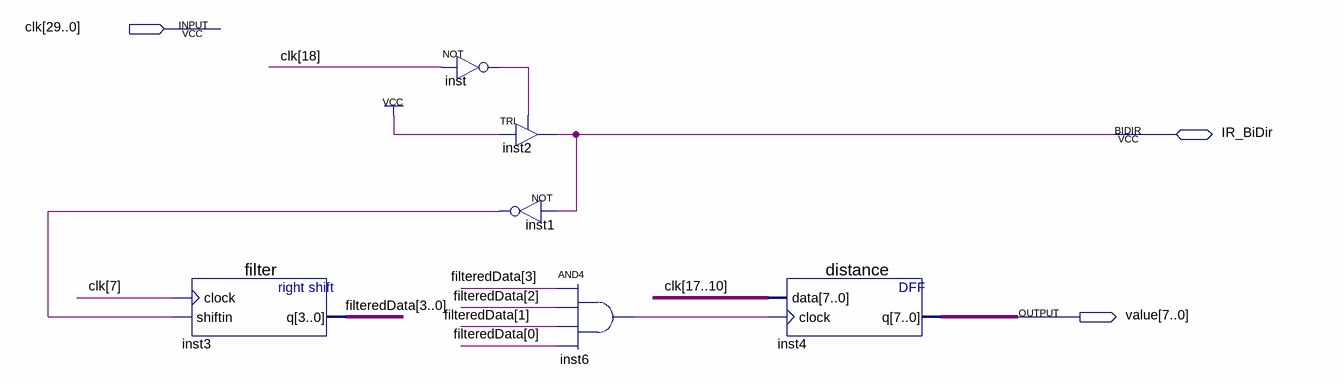
[diagram p0: schematic sheet]
// Quartus schematic IR_Sensor.bdf as structural Verilog: 6 symbols, 3 pins
module IR_Sensor (
  input  [29:0] clk,
  inout  IR_BiDir,
  output [7:0] value
);

  wire inst1_out, inst6_out, inst_out;
  wire [3:0] filteredData;

  filter inst3 (.clock(clk[7]), .shiftin(inst1_out), .q(filteredData));
  not inst (inst_out, clk[18]);
  TRI inst2 (.IN(1'b1), .OE(inst_out), .OUT(IR_BiDir));
  not inst1 (inst1_out, IR_BiDir);
  and inst6 (inst6_out, filteredData[3], filteredData[2], filteredData[1], filteredData[0]);
  distance inst4 (.data(clk[17:10]), .clock(inst6_out), .q(value));
endmodule
